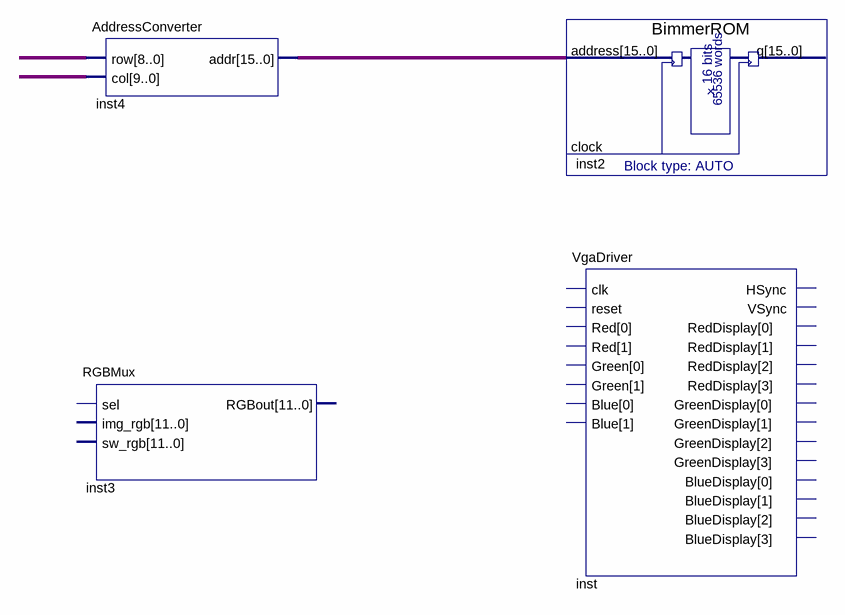
[diagram p0: schematic sheet]
// Quartus schematic VgaDisplay.bdf as structural Verilog: 4 symbols, 0 pins
module VgaDisplay (
);

  wire [8:0] undriven;
  wire [9:0] undriven_2;
  wire [15:0] inst4_addr;

  AddressConverter inst4 (.row(undriven), .col(undriven_2), .addr(inst4_addr));
  RGBMux inst3 ();  // open: sel, img_rgb, sw_rgb, RGBout
  BimmerROM inst2 (.address(inst4_addr));  // open: clock, q
  VgaDriver inst ();  // open: clk, reset, Red, Green, Blue, HSync, VSync, RedDisplay, GreenDisplay, BlueDisplay
endmodule
